# Altium project DDW.PrjPcb
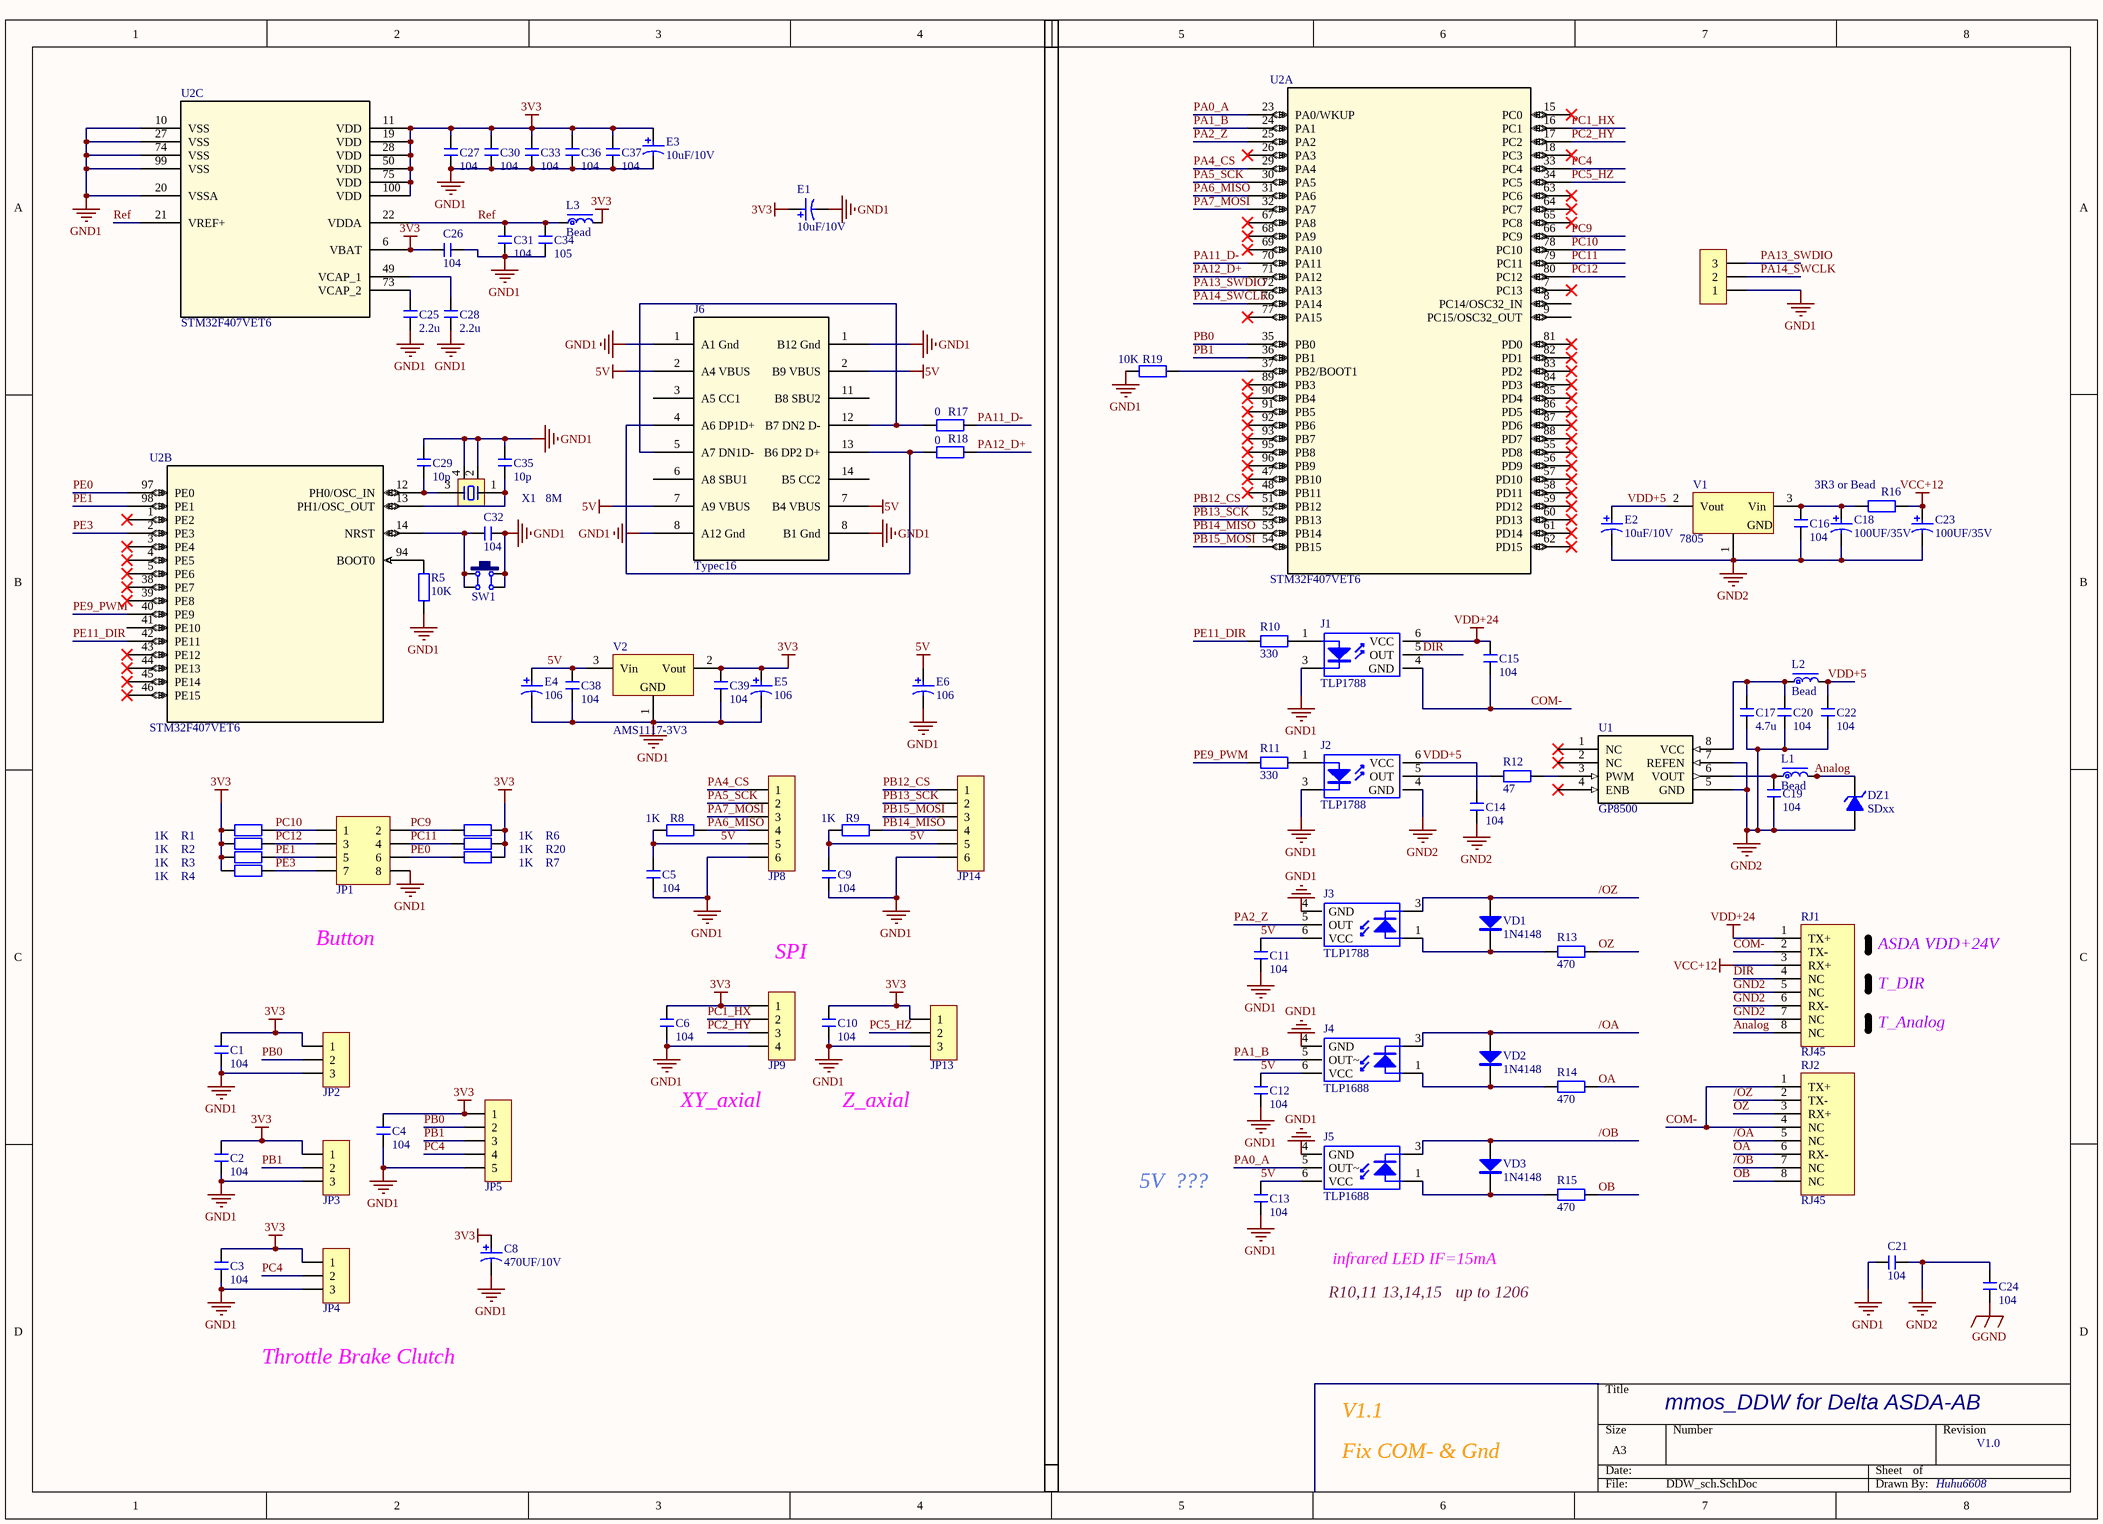
[diagram p0: DDW_sch.SchDoc]
1 sheet, 95 parts. Net scope: global (net labels, ports and power ports of the same name join across sheets).
Board file: DDW_pcb.PcbDoc

## Sheet DDW_sch.SchDoc
size A3

### Parts
C1  104  [C 0603]
C2  104  [C 0603]
C3  104  [C 0603]
C4  104  [C 0603]
C5  104  [C 0603]
C6  104  [C 0603]
C8  470UF/10V  [CAP 2.5*6.3*11.2]
C9  104  [C 0603]
C10  104  [C 0603]
C11  104  [C 0603]
C12  104  [C 0603]
C13  104  [C 0603]
C14  104  [C 0603]
C15  104  [C 0603]
C16  104  [C 0603]
C17  4.7u  [C 0603]
C18  100UF/35V  [CAP 2.5*6.3*11.2]
C19  104  [C 0603]
C20  104  [C 0603]
C21  104  [Y]
C22  104  [C 0603]
C23  100UF/35V  [CAP 2.5*6.3*11.2]
C24  104  [Y]
C25  2.2u  [C 0603]
C26  104  [C 0603]
C27  104  [C 0603]
C28  2.2u  [C 0603]
C29  10p  [C 0603]
C30  104  [C 0603]
C31  104  [C 0603]
C32  104  [C 0603]
C33  104  [C 0603]
C34  105  [C 0603]
C35  10p  [C 0603]
C36  104  [C 0603]
C37  104  [C 0603]
C38  104  [C 0603]
C39  104  [C 0603]
DZ1  SDxx  [SOD-323]
E1  10uF/10V  [CD B(3528)]
E2  10uF/10V  [CD B(3528)]
E3  10uF/10V  [CD B(3528)]
E4  106  [CD B(3528)]
E5  106  [CD B(3528)]
E6  106  [CD B(3528)]
J1  TLP1788  [SOP5]
J2  TLP1788  [SOP5]
J3  TLP1788  [SOP5]
J4  TLP1688  [SOP5]
J5  TLP1688  [SOP5]
J6  Typec16  [typec 16p]
JP1  Header 4X2  [HDR-4X2]  (value not drawn)
JP2  HDR-1X3  [HDR-1X3]  (value not drawn)
JP3  HDR-1X3  [HDR-1X3]  (value not drawn)
JP4  HDR-1X3  [HDR-1X3]  (value not drawn)
JP5  HDR-1X5  [HDR-1X5]  (value not drawn)
JP6  HDR-1X3  [HDR-1X3]  (value not drawn)
JP8  HDR-1X6  [HDR-1X6]  (value not drawn)
JP9  HDR-1X4  [HDR-1X4]  (value not drawn)
JP13  HDR-1X3  [HDR-1X3]  (value not drawn)
JP14  HDR-1X6  [HDR-1X6]  (value not drawn)
L1  Bead  [L 0805]
L2  Bead  [L 0805]
L3  Bead  [L 0603]
R1  1K  [Res-SMD-0603]
R2  1K  [Res-SMD-0603]
R3  1K  [Res-SMD-0603]
R4  1K  [Res-SMD-0603]
R5  10K  [Res-SMD-0603]
R6  1K  [Res-SMD-0603]
R7  1K  [Res-SMD-0603]
R8  1K  [Res-SMD-0603]
R9  1K  [Res-SMD-0603]
R10  330  [Res-SMD-1206]
R11  330  [Res-SMD-1206]
R12  47  [Res-SMD-0603]
R13  470  [Res-SMD-1206]
R14  470  [Res-SMD-1206]
R15  470  [Res-SMD-1206]
R16  3R3 or Bead  [Res-SMD-1206]
R17  0  [Res-SMD-0603]
R18  0  [Res-SMD-0603]
R19  10K  [Res-SMD-0603]
R20  1K  [Res-SMD-0603]
RJ1  RJ45  [RJ45-2]
RJ2  RJ45  [RJ45-2]
SW1  6x6x5  [TSW DIP-6*6*5]  (value not drawn)
U1  GP8500  [SOP8_N]
U2  STM32F407VET6  [TQFP100 14x14_N]  (parts A,B,C of 3)
V1  7805  [SOT89_N]
V2  AMS1117-3V3  [SOT223_N]
VD1  1N4148  [MINI_MELF (LL34)]
VD2  1N4148  [MINI_MELF (LL34)]
VD3  1N4148  [MINI_MELF (LL34)]
X1  8M  [XTAL-3225]

### Nets
3V3: C1.1 C2.1 C3.1 C4.1 C6.1 C8.A C10.1 C26.2 C27.2 C30.2 C33.2 C36.2 C37.2 C39.1 E1.A E3.A E5.A JP2.1 JP3.1 JP4.1 JP5.1 JP9.1 JP13.1 L3.2 R1.2 R2.2 R3.2 R4.2 R6.1 R7.1 R20.1 U2.6(VBAT) U2.11(VDD) U2.19(VDD) U2.28(VDD) U2.50(VDD) U2.75(VDD) U2.100(VDD) V2.2(Vout)
5V: C5.1 C9.1 C11.1 C12.1 C13.1 C38.1 E4.A E6.A J3.6(VCC) J4.6(VCC) J5.6(VCC) J6.2(A4_VBUS) J6.7(A9_VBUS) JP8.5 JP14.5 R8.2 R9.2 V2.3(Vin)
GGND: C24.2
GND1: C1.2 C2.2 C3.2 C4.2 C5.2 C6.2 C8.K C9.2 C10.2 C11.2 C12.2 C13.2 C21.1 C25.1 C26.1 C27.1 C28.1 C29.2 C30.1 C31.2 C32.2 C33.1 C34.2 C35.2 C36.1 C37.1 C38.2 C39.2 E1.K E3.K E4.K E5.K E6.K J1.3(K) J2.3(K) J3.4(GND) J4.4(GND) J5.4(GND) J6.1(A1_Gnd) J6.8(A12_Gnd) JP1.8 JP2.3 JP3.3 JP4.3 JP5.5 JP6.1 JP8.6 JP9.4 JP13.3 JP14.6 R5.2 R19.2 SW1.2 SW1.3 U2.10(VSS) U2.20(VSSA) U2.27(VSS) U2.74(VSS) U2.99(VSS) V2.1(GND) X1.2 X1.4
GND2: C14.2 C16.2 C17.2 C18.K C19.2 C20.2 C21.2 C22.2 C23.K C24.1 DZ1.1(A) E2.K J2.4(GND) RJ1.5(NC) RJ1.6(RX-) RJ1.7(NC) U1.5(GND) U1.7(REFEN) V1.1(GND)
VCC+12: C23.A R16.2 RJ1.3(RX+)
VDD+24: C15.1 J1.6(VCC) RJ1.1(TX+)
/OA: J4.3(K) RJ2.5(NC) VD2.1(A)
/OB: J5.3(K) RJ2.7(NC) VD3.1(A)
/OZ: J3.3(K) RJ2.2(TX-) VD1.1(A)
Analog: DZ1.2(K) L1.2 RJ1.8(NC)
COM-: C15.2 J1.4(GND) RJ1.2(TX-) RJ2.1(TX+) RJ2.4(NC)
DIR: J1.5(OUT) RJ1.4(NC)
OA: R14.2 RJ2.6(RX-)
OB: R15.2 RJ2.8(NC)
OZ: R13.2 RJ2.3(RX+)
PA0_A: J5.5(OUT~) U2.23(PA0/WKUP)
PA1_B: J4.5(OUT~) U2.24(PA1)
PA2_Z: J3.5(OUT) U2.25(PA2)
PA4_CS: JP8.1 U2.29(PA4)
PA5_SCK: JP8.2 U2.30(PA5)
PA6_MISO: JP8.4 R8.1 U2.31(PA6)
PA7_MOSI: JP8.3 U2.32(PA7)
PA11_D-: R17.1 U2.70(PA11)
PA12_D+: R18.1 U2.71(PA12)
PA13_SWDIO: JP6.3 U2.72(PA13)
PA14_SWCLK: JP6.2 U2.76(PA14)
PB0: JP2.2 JP5.2 U2.35(PB0)
PB1: JP3.2 JP5.3 U2.36(PB1)
PB12_CS: JP14.1 U2.51(PB12)
PB13_SCK: JP14.2 U2.52(PB13)
PB14_MISO: JP14.4 R9.1 U2.53(PB14)
PB15_MOSI: JP14.3 U2.54(PB15)
PC1_HX: JP9.2 U2.16(PC1)
PC2_HY: JP9.3 U2.17(PC2)
PC4: JP4.2 JP5.4 U2.33(PC4)
PC5_HZ: JP13.2 U2.34(PC5)
PC9: JP1.2 R6.2 U2.66(PC9)
PC10: JP1.1 R1.1 U2.78(PC10)
PC11: JP1.4 R20.2 U2.79(PC11)
PC12: JP1.3 R2.1 U2.80(PC12)
PE0: JP1.6 R7.2 U2.97(PE0)
PE1: JP1.5 R3.1 U2.98(PE1)
PE3: JP1.7 R4.1 U2.2(PE3)
PE9_PWM: R11.1 U2.40(PE9)
PE11_DIR: R10.1 U2.42(PE11)
Ref: C31.1 C34.1 L3.1 U2.21(VREF+) U2.22(VDDA)
VDD+5: C14.1 C22.1 E2.A J2.6(VCC) L2.2 V1.2(Vout)
NetC16_1: C16.1 C18.A R16.1 V1.3(Vin)
NetC17_1: C17.1 C20.1 L2.1 U1.8(VCC)
NetC19_1: C19.1 L1.1 U1.6(VOUT)
NetC25_2: C25.2 U2.73(VCAP_2)
NetC28_2: C28.2 U2.49(VCAP_1)
NetC29_1: C29.1 U2.12(PH0/OSC_IN) X1.3
NetC32_1: C32.1 SW1.1 SW1.4 U2.14(NRST)
NetC35_1: C35.1 U2.13(PH1/OSC_OUT) X1.1
NetJ1_1: J1.1(A) R10.2
NetJ2_1: J2.1(A) R11.2
NetJ2_5: J2.5(OUT) R12.1
NetJ3_1: J3.1(A) R13.1 VD1.2(K)
NetJ4_1: J4.1(A) R14.1 VD2.2(K)
NetJ5_1: J5.1(A) R15.1 VD3.2(K)
NetJ6_4: J6.4(A6_DP1D+) J6.13(B6_DP2_D+) R18.2
NetJ6_5: J6.5(A7_DN1D-) J6.12(B7_DN2_D-) R17.2
NetR5_1: R5.1 U2.94(BOOT0)
NetR12_2: R12.2 U1.3(PWM)
NetR19_1: R19.1 U2.37(PB2/BOOT1)

Not connected (* = marked no-connect by the designer): J6 3(A5_CC1) 6(A8_SBU1) 11(B8_SBU2) 14(B5_CC2); U1 1(NC)* 2(NC)* 4(ENB)*; U2 1(PE2)* 3(PE4)* 4(PE5)* 5(PE6)* 7(PC13)* 8(PC14/OSC32_IN) 9(PC15/OSC32_OUT) 15(PC0)* 18(PC3)* 26(PA3)* 38(PE7)* 39(PE8)* 41(PE10) 43(PE12)* 44(PE13)* 45(PE14)* 46(PE15)* 47(PB10)* 48(PB11)* 55(PD8)* 56(PD9)* 57(PD10)* 58(PD11)* 59(PD12)* 60(PD13)* 61(PD14)* 62(PD15)* 63(PC6)* 64(PC7)* 65(PC8)* 67(PA8)* 68(PA9)* 69(PA10)* 77(PA15)* 81(PD0)* 82(PD1)* 83(PD2)* 84(PD3)* 85(PD4)* 86(PD5)* 87(PD6)* 88(PD7)* 89(PB3)* 90(PB4)* 91(PB5)* 92(PB6)* 93(PB7)* 95(PB8)* 96(PB9)*

### Notes on the sheet
- Button
- SPI
- ASDA VDD+24V
- T_DIR
- T_Analog
- XY_axial
- Z_axial
- (near C13) 5V  ???
- infrared LED IF=15mA
- R10,11 13,14,15   up to 1206
- Throttle Brake Clutch
- mmos_DDW for Delta ASDA-AB
- V1.1
- Fix COM- & Gnd
- V1.0
- Huhu6608

### Library data of the parts
C1-C6 C9-C17 C19-C22 C24-C39 = Cap-CER-SMD: 瓷片电容-贴片
C8 C18 C23 = Cap-AE-RAD: 铝电解电容-直插
DZ1 = SDxx: TVS; BOM名称: 3V/0.5W稳压管; 版权归属: 源创客; 学习资源: www.ooocke.com
E1-E6 = Cap-TAN-SMD: 钽电解电容-贴片
J1 J2 = TLP1788: 光耦; 版权归属: 源创客; BOM名称: 光耦; 学习资源: www.ooocke.com
J3 = TLP181: 光耦; 版权归属: 源创客; BOM名称: 光耦; 学习资源: www.ooocke.com
J4 J5 = TLP1688: 光耦; 版权归属: 源创客; BOM名称: 光耦; 学习资源: www.ooocke.com
JP1 = Header 4X2: 4*2P接插件; 版权归属: 源创客; BOM名称: 4*2P接插件; 学习资源: www.ooocke.com
JP2-JP4 JP6 JP13 = Header 3: 3P接插件; 版权归属: 源创客; BOM名称: 3P接插件; 学习资源: www.ooocke.com
JP5 = Header 5: 5P接插件; 版权归属: 源创客; BOM名称: 5P接插件; 学习资源: www.ooocke.com
JP8 JP14 = Header 6: 6P接插件; 版权归属: 源创客; BOM名称: 6P接插件; 学习资源: www.ooocke.com
JP9 = Header 4: 4P接插件; 版权归属: 源创客; BOM名称: 4P接插件; 学习资源: www.ooocke.com
L2 = Ind-Beads-SMD
R1-R20 = Res-Fixed-SMD: 固定电阻器-贴片
RJ1 RJ2 = RJ45: 以太网接口; 版权归属: 源创客; BOM名称: 以太网接口; 学习资源: www.ooocke.com
SW1 = TSW DIP-6x6: 直插6x6轻触开关; 版权归属: 源创客; BOM名称: 直插6x6轻触开关; 学习资源: www.ooocke.com
U1 = GP8500: PAC; Manufacturer_Part_Number: ltc2644ims-l12#pbf; Vendor: Linear Technology; Value: Value; Type: Type; RefDes: RefDes
U2 = STM32F407VET6: No Description Available; Vendor: STMicroelectronics; Built_By: EMA_UL_Team; SourceLibrary: Updates_to_database_2020-10-19; Manufacturer_Part_Number: STM32F407VET6; Copyright: Copyright (C) 2018 Accelerated Designs. All rights reserved; RefDes: RefDes; Type: DEV
V1 V2 = 78LDO: 三端稳压芯片; BOM名称: 稳压芯片; 版权归属: 源创客; 学习资源: www.ooocke.com
VD1-VD3 = 1N4148: 高速开关二极管; 版权归属: 源创客; BOM名称: 高速开关二极管; 学习资源: www.ooocke.com
X1 = XTAL-4: 4脚晶振; 版权归属: 源创客; BOM名称: 4脚晶振; 学习资源: www.ooocke.com